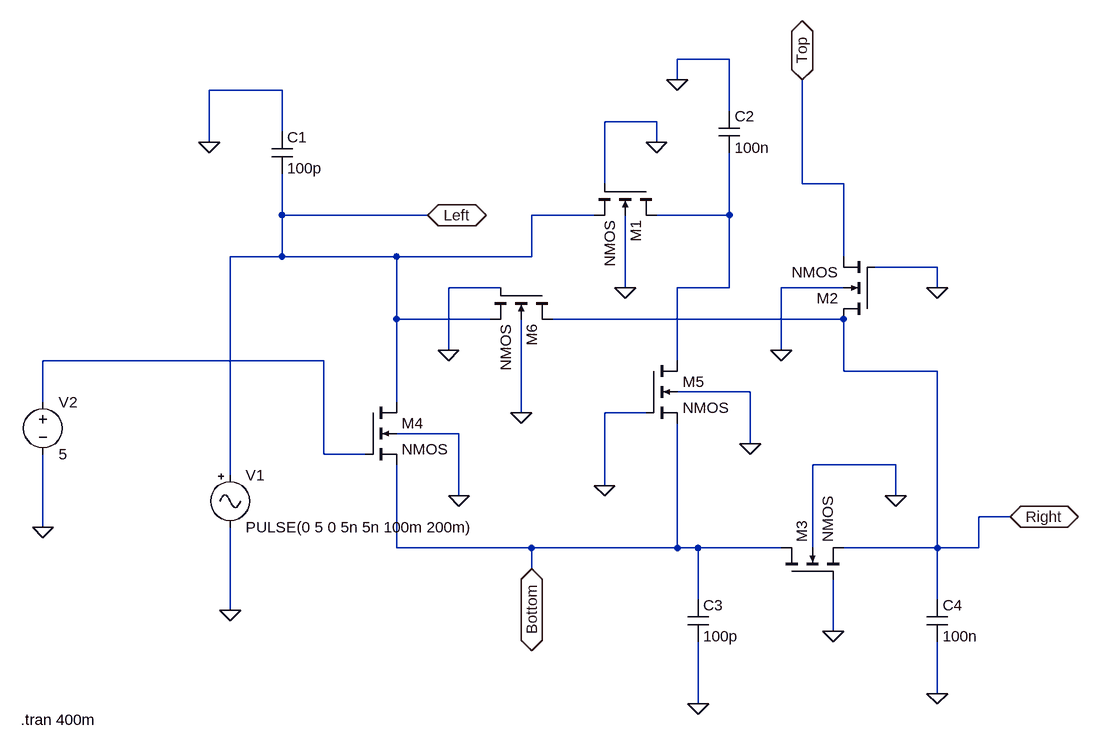
[diagram p0: schematic Circuit2_2_2.asc]
Circuit2_2_2.asc, the LTspice schematic file:
Version 4
SHEET 1 1032 760
WIRE 480 -272 400 -272
WIRE 400 -240 400 -272
WIRE -208 -224 -320 -224
WIRE 480 -192 480 -272
WIRE 368 -176 288 -176
WIRE -208 -160 -208 -224
WIRE -320 -144 -320 -224
WIRE 368 -144 368 -176
WIRE 288 -80 288 -176
WIRE 592 -80 592 -240
WIRE 656 -80 592 -80
WIRE -208 -32 -208 -96
WIRE 16 -32 -208 -32
WIRE 272 -32 176 -32
WIRE 480 -32 480 -128
WIRE 480 -32 368 -32
WIRE -208 32 -208 -32
WIRE -208 32 -288 32
WIRE -32 32 -208 32
WIRE 176 32 176 -32
WIRE 176 32 -32 32
WIRE 656 32 656 -80
WIRE 800 48 704 48
WIRE 128 80 48 80
WIRE 320 80 320 -32
WIRE 480 80 480 -32
WIRE 480 80 400 80
WIRE 656 80 560 80
WIRE 800 80 800 48
WIRE -32 128 -32 32
WIRE 112 128 -32 128
WIRE 656 128 208 128
WIRE 48 176 48 80
WIRE 560 176 560 80
WIRE -144 192 -576 192
WIRE 400 192 400 80
WIRE 656 208 656 128
WIRE 800 208 656 208
WIRE 512 240 400 240
WIRE -576 256 -576 192
WIRE -32 256 -32 128
WIRE 160 272 160 128
WIRE 352 272 288 272
WIRE 64 304 -32 304
WIRE 512 320 512 240
WIRE -144 336 -144 192
WIRE -80 336 -144 336
WIRE 736 352 608 352
WIRE -288 368 -288 32
WIRE 288 384 288 272
WIRE 64 400 64 304
WIRE 736 400 736 352
WIRE 912 432 864 432
WIRE -576 448 -576 336
WIRE -32 480 -32 352
WIRE 176 480 -32 480
WIRE 400 480 400 288
WIRE 400 480 176 480
WIRE 432 480 400 480
WIRE 560 480 432 480
WIRE 608 480 608 352
WIRE 800 480 800 208
WIRE 800 480 656 480
WIRE 864 480 864 432
WIRE 864 480 800 480
WIRE 176 512 176 480
WIRE 432 560 432 480
WIRE 800 560 800 480
WIRE -288 576 -288 448
WIRE 640 608 640 528
WIRE 800 704 800 624
WIRE 432 720 432 624
FLAG 592 -240 Top
IOPIN 592 -240 BiDir
FLAG 912 432 Right
IOPIN 912 432 BiDir
FLAG 16 -32 Left
IOPIN 16 -32 BiDir
FLAG 176 512 Bottom
IOPIN 176 512 BiDir
FLAG -320 -144 0
FLAG 368 -144 0
FLAG 400 -240 0
FLAG 800 80 0
FLAG 640 608 0
FLAG 800 704 0
FLAG 432 720 0
FLAG -288 576 0
FLAG -576 448 0
FLAG 64 400 0
FLAG 160 272 0
FLAG 736 400 0
FLAG 512 320 0
FLAG 320 80 0
FLAG 560 176 0
FLAG 48 176 0
FLAG 288 384 0
SYMBOL nmos4 368 -80 R90
SYMATTR InstName M1
SYMBOL nmos4 704 128 R180
SYMATTR InstName M2
SYMBOL nmos4 560 528 R270
SYMATTR InstName M3
SYMBOL nmos4 -80 256 R0
SYMATTR InstName M4
SYMBOL nmos4 352 192 R0
SYMATTR InstName M5
SYMBOL nmos4 208 80 R90
SYMATTR InstName M6
SYMBOL cap -224 -160 R0
SYMATTR InstName C1
SYMATTR Value 100p
SYMBOL cap 464 -192 R0
SYMATTR InstName C2
SYMATTR Value 100n
SYMBOL cap 416 560 R0
SYMATTR InstName C3
SYMATTR Value 100p
SYMBOL cap 784 560 R0
SYMATTR InstName C4
SYMATTR Value 100n
SYMBOL Misc\\signal -288 352 R0
WINDOW 123 0 0 Left 0
WINDOW 39 0 0 Left 0
SYMATTR InstName V1
SYMATTR Value PULSE(0 5 0 5n 5n 100m 200m)
SYMBOL voltage -576 240 R0
WINDOW 123 0 0 Left 0
WINDOW 39 0 0 Left 0
SYMATTR InstName V2
SYMATTR Value 5
TEXT -610 744 Left 2 !.tran 400m

The netlist it stands for:
* Circuit2_2_2.asc
M1 N001 0 Left 0 NMOS
M2 Right 0 Top 0 NMOS
M3 Bottom 0 Right 0 NMOS
M4 Left N002 Bottom 0 NMOS
M5 N001 0 Bottom 0 NMOS
M6 Right 0 Left 0 NMOS
C1 0 Left 100p
C2 0 N001 100n
C3 Bottom 0 100p
C4 Right 0 100n
V1 Left 0 PULSE(0 5 0 5n 5n 100m 200m)
V2 N002 0 5
.model NMOS NMOS
.model PMOS PMOS
.lib standard.mos
.tran 400m
.backanno
.end